# EAGLE design DHJSNoiseConsole (EAGLE 6.6.0)
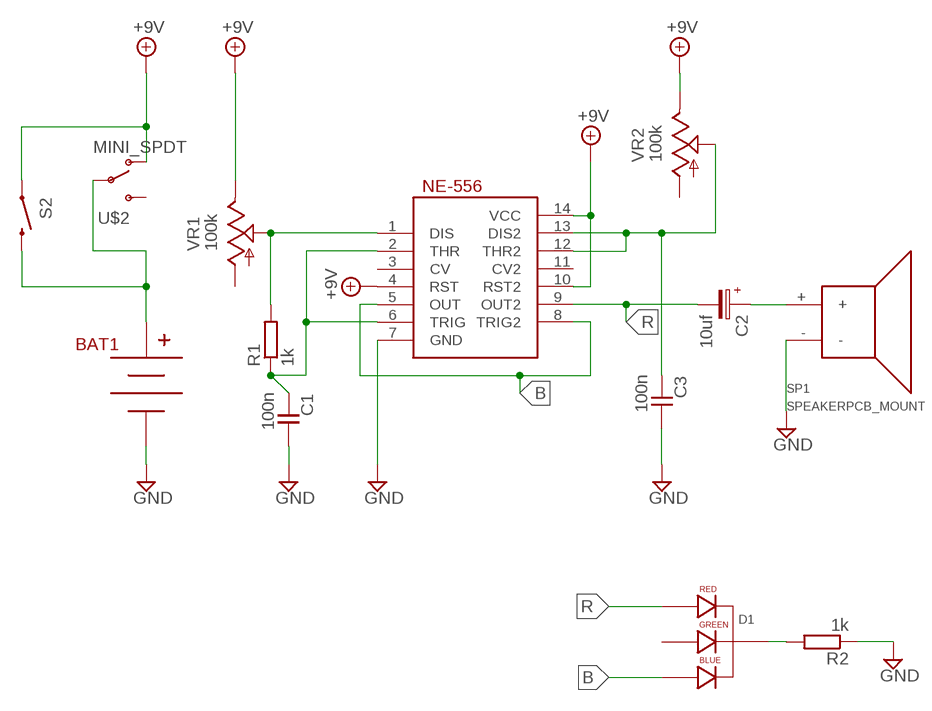
[diagram p0: schematic, sheet 1]

## Parts
BAT1  BC9VPC  [BC9VPC]
C1  100n  C-EU050-024X044  [C050-024X044]
C2  10uf  050-EU  [050_020]
C3  100n  C-EU050-024X044  [C050-024X044]
D1  LED-RGB-CC-THRUCLEAR  [LED-RGB-THRU]
NE-556  556  [DIL14]
R1  1k  RESISTOR10MM_RESISTOR  [10MM_RESISTOR]
R2  1k  RESISTOR10MM_RESISTOR  [10MM_RESISTOR]
S2  SWITCH-MOMENTARY-2SIDE_EZ  [TACTILE-PTH-SIDEEZ]
SP1  SPEAKERPCB_MOUNT  [PCB_MOUNT_SPEAKER]
U$2  MINI_SPDT  [MINI_SPDT_RIGHTANGLE]
VR1  100k  9MM_SNAP-IN_POT_  [9MM_SNAP-IN_POT]
VR2  100k  9MM_SNAP-IN_POT_  [9MM_SNAP-IN_POT]

## Nets
+9V: NE-556.4(RST) NE-556.10(RST2) NE-556.14(VCC) S2.1 U$2.UP(O) VR1.3(E) VR2.3(E)
B: D1.4(BLUE_CATHODE) NE-556.5(OUT) NE-556.8(TRIG2)
GND: BAT1.V- C1.1 C3.1 NE-556.7(GND) R2.1 SP1.-
N$1: NE-556.1(DIS) R1.2 VR1.2(S)
N$2: BAT1.V+ S2.2 U$2.COMMON
N$3: C3.2 NE-556.12(THR2) NE-556.13(DIS2) VR2.2(S)
N$4: D1.2(CATHODE) R2.2
N$6: C1.2 NE-556.2(THR) NE-556.6(TRIG) R1.1
N$7: C2.+ SP1.+
R: C2.- D1.1(RED_CATHODE) NE-556.9(OUT2)
Unconnected: D1.3(GREEN_CATHODE) NE-556.3(CV) NE-556.11(CV2) U$2.DOWN(S) VR1.1(A) VR2.1(A)

## Library data of the parts
BAT1 = SparkFun-Connectors:BC9VPC: 9V board-mount battery cradle; PROD_ID: BATT-10855
C1 C3 = TomW:C-EU: CAPACITOR, European symbol
C2 = gm-caps-electro-pol:050-EU
D1 = SparkFun-LED:LED-RGB-CC-THRU: RGB Through-hole common cathode LED SparkFun Storefront: COM-00105 (Clear) COM-09264 (Diffuse); PROD_ID: DIO-08418
NE-556 = SparkFun-AnalogIC:556: Dual timer circuit (2 555 timers in one package)
R1 R2 = MusicThingModular:RESISTOR: Standard resistor, various versions
S2 = SparkFun-Electromechanical:SWITCH-MOMENTARY-2: Various NO switches- pushbuttons, reed, etc
SP1 = SparkFun-Electromechanical:SPEAKER: General speakers.; MFG: SANCO; PROD_#: NA; SKU: COM-11089; SPARKLE_ID: 6504
U$2 = MusicThingModular:MINI_SPDT
VR1 VR2 = MusicThingModular:9MM_SNAP-IN_POT: 9mm vertical snap-in pot, Alpha / Panasonic style

## Net classes
0 default: width 0.61 mm

## Board
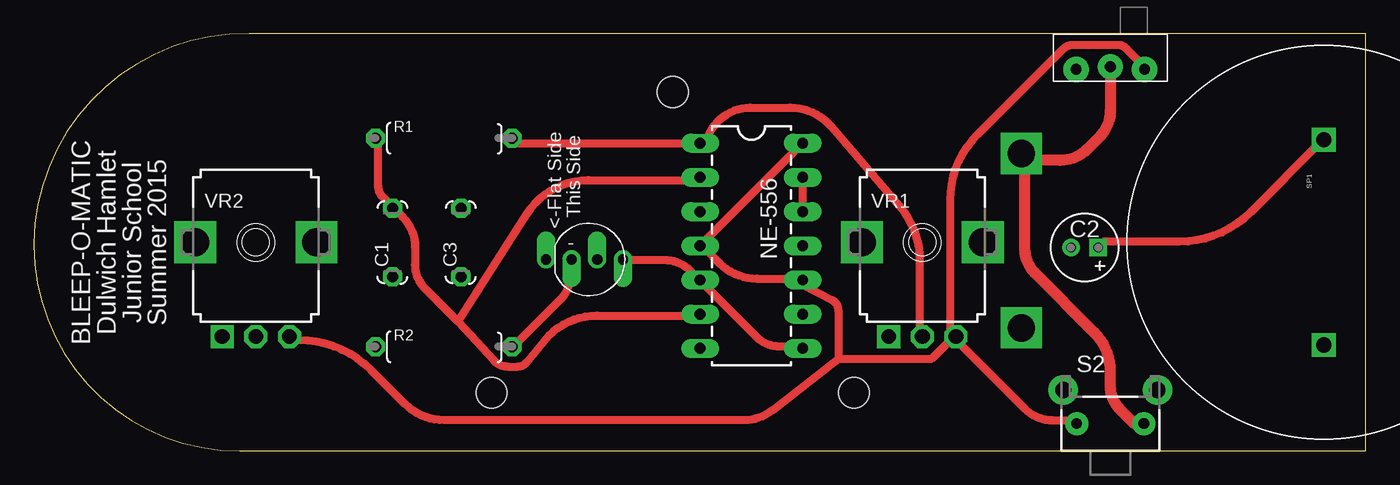
[diagram p1: board, top side]
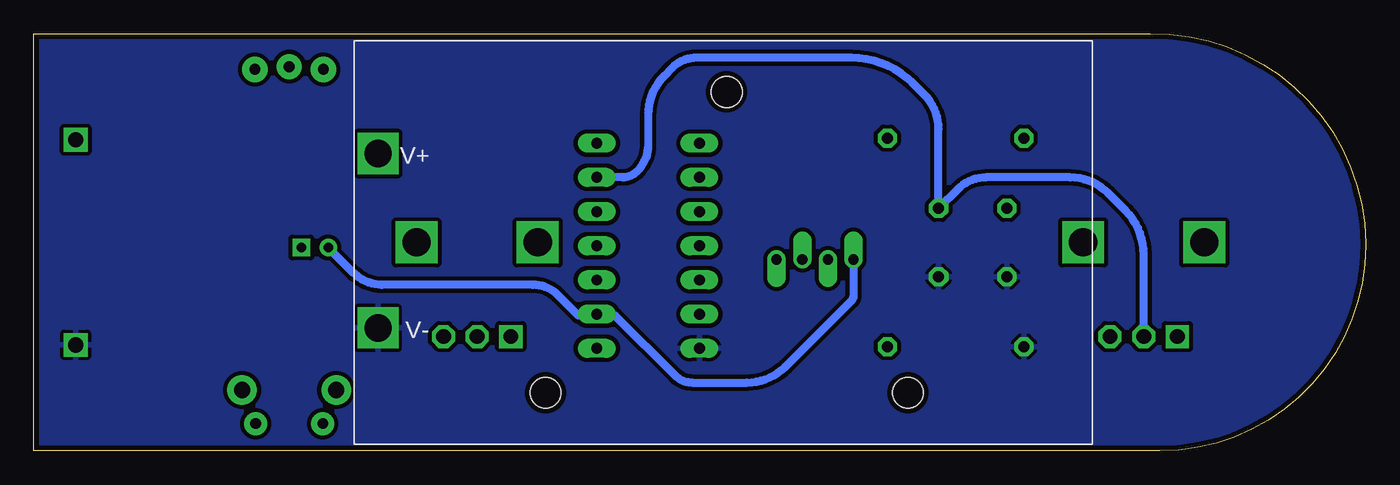
[diagram p2: board, bottom side, seen from below]

Size 99 x 31 mm. Coordinates in mm from the lower left corner, seen from the top.
Outline: 99,31 16.01,31 arc90 0,15.41 0,15.29 arc90 15.29,0 99,0 99,31
Copper layers (1*2*15*16): Top 0.035mm / dielectric 0.2mm / Route2 0.0175mm / dielectric 1.1mm / Route15 0.0175mm / dielectric 0.2mm / Bottom 0.035mm
Design rules "MT design rules rev2": minimum track width 6mil, minimum drill 12mil, track to track 12mil, track to pad 12mil, pad to pad 10mil, via to via 10mil, smd to smd 0mil, copper to edge 15mil, drill to drill 13mil, minimum pad ring 12mil, minimum via ring 6mil, stop-mask expansion 2mil, vias tented up to drill 25mil, thermal gap 10mil

### Footprints (pad centres in the part's own frame; a part is rotated, then mirrored left to right if it is on the bottom)
BC9VPC = drill 2.032 square: V+ 53.086,8.382; V- 53.086,21.336 | hole 2.286: 27.178,3.81; 13.716,26.162; 40.64,26.162
C050-024X044 = drill 0.813 octagon: 1 -2.54,0; 2 2.54,0
050_020 = drill 0.7 square: + -1,0 | drill 0.7: - 1,0
LED-RGB-THRU = drill 0.762 pad 0.889 offset: 1 3.175,0; 2 1.27,0; 3 -0.635,0; 4 -2.54,0
DIL14 = drill 0.813 long: 1 -8.89,-3.81; 2 -6.35,-3.81; 3 -3.81,-3.81; 4 -1.27,-3.81; 5 1.27,-3.81; 6 3.81,-3.81; 7 6.35,-3.81; 8 6.35,3.81; 9 3.81,3.81; 10 1.27,3.81; 11 -1.27,3.81; 12 -3.81,3.81; 13 -6.35,3.81; 14 -8.89,3.81
10MM_RESISTOR = drill 0.813 octagon: 1 -5.08,0; 2 5.08,0
TACTILE-PTH-SIDEEZ = drill 0.8 pad 1.7: 1 -2.5,0; 2 2.5,0 | drill 1.2 pad 2.2: ANCHOR1 -3.5,2.5; ANCHOR2 3.5,2.5
PCB_MOUNT_SPEAKER = drill 1.143 square: + -7.62,0; - 7.62,0
MINI_SPDT_RIGHTANGLE = drill 0.8 pad 1.88: COMMON -0.1,0; DOWN 0.1,-2.54; UP 0.1,2.54
9MM_SNAP-IN_POT = drill 1.1 pad 1.676 square: 1 -2.5,-7 | drill 1.1 pad 1.676 octagon: 2 0,-7; 3 2.5,-7 | drill 2.1 pad 2.8 square: M1 4.5,0; M2 -4.5,0

### Placement (x,y rotation side)
BAT1  20.32,30.48 180 bottom
C1  26.67,15.49 90 top
C2  78.11,15.11 180 top
C3  31.75,15.49 90 top
D1  41.25,14.23 180 top
NE-556  53.34,13.97 270 top
R1  30.48,23.24 0 top
R2  30.48,7.75 0 top
S2  80.01,2.03 0 top
SP1  95.88,15.5 270 top
U$1  [MTM_1CM_KEEPOUT]  92.71,19.05 0 bottom
U$2  80.01,28.45 270 top
VR1  66.04,15.5 0 top
VR2  16.51,15.5 0 top

### Tracks (layer width: path | path; a pad name or v marks a point on that pad's centre or on a via)
+9V
  Top 0.61: S2.1 77.27,2.29 75.69,2.29 arc-45 73.7,3.11 68.58,8.23 VR1.3 | U$2.UP 82.3,28.8 81.21,29.89 arc45 80.53,30.18 77.29,30.18 arc45 76.47,29.83 70.15,23.52 arc45 68.12,18.62 68.12,8.69 VR1.3 | NE-556.14 NE-556.4 49.84,15.09 50.98,13.95 arc45 53.74,12.8 57.15,12.8 NE-556.10 57.15,12.34 59.35,11.2 arc-63 59.79,10.47 59.79,6.86 | 59.79,6.86 54.86,3 arc-38 52.79,2.29 30.5,2.29 arc-45 27.61,3.48 25.09,6 arc45 19.7,8.23 19.2,8.23 VR2.3 | 59.79,6.86 66.75,6.86 68.12,8.23 VR1.3
B
  Top 0.61: D1.4 43.89,14.17 46.88,14.17 arc-45 48.8,13.38 49.38,12.8 NE-556.5 49.84,12.34 53.7,8.47 arc45 55.4,7.77 57.15,7.77 NE-556.8
GND
  pour Bottom: -1.27,34.29 100.33,35.56 100.33,-1.27 -1.27,-2.54
N$1
  Top 0.61: R1.2 35.66,22.86 NE-556.1 49.84,22.86 50.26,23.67 arc-63 53.27,25.5 56.22,25.5 arc-49 59.27,24.1 64.35,18.19 arc-41 65.84,14.18 65.84,8.69 VR1.2
N$2
  Top 0.813: S2.2 81.79,2.03 80.75,3.07 arc-45 80.01,4.86 80.01,5.96 arc45 78.83,8.8 74.4,13.23 arc-45 73.66,15.02 73.66,21.59 | 73.66,21.59 73.66,21.84 BAT1.V+ | U$2.COMMON 80.01,25.31 arc-45 79.18,23.3 78.3,22.42 arc-45 76.29,21.59 73.66,21.59
N$3
  Top 0.61: NE-556.13 NE-556.12
  Bottom 0.61: VR2.2 16.51,14.61 arc-45 17.85,17.85 19.14,19.14 arc-45 21.98,20.32 28.24,20.32 arc-45 30.33,19.45 C3.2 31.75,23.91 arc-45 32.8,26.45 33.66,27.31 arc-45 38.24,29.21 49.75,29.21 arc-45 51.54,28.47 52.16,27.85 arc-45 53.34,25.01 53.34,22.77 arc45 54.17,20.76 arc45 55.23,20.32 NE-556.13
N$4
  Top 0.61: D1.2 39.78,14.17 39.78,12.66 arc-45 39.23,11.34 35.66,7.77 R2.2
N$6
  Top 0.61: R1.1 25.6,22.86 25.6,19.65 arc45 25.92,18.89 26.52,18.29 C1.2 26.98,17.83 27.41,17.39 arc-45 28.35,15.14 28.35,13.81 arc45 29.06,12.09 31.55,9.6 | 31.55,9.6 34.21,6.72 arc47 35.23,6.27 35.99,6.27 arc50 36.62,6.57 38.3,8.58 arc-45 41.87,10.06 49.38,10.06 NE-556.6 | 31.55,9.6 36.65,17.61 arc-57 41.23,20.12 49.38,20.12 NE-556.2
N$7
  Top 0.61: C2.+ 79.55,15.54 85.14,15.54 arc45 90.43,17.74 95.56,22.86 SP1.+
R
  Bottom 0.61: C2.- 75.21,13.21 arc-45 73.11,12.34 61.89,12.34 arc45 60.04,11.58 58.52,10.06 57.15,10.06 | 57.15,10.06 55.78,10.06 51.33,5.61 arc-45 50.06,5.08 46,5.08 arc-45 43.13,6.27 38.19,11.21 arc-45 38.1,11.43 38.08,11.46 D1.1 | 57.15,10.06 NE-556.9

### Text on the board
tPlace: <-Flat Side / This Side | BLEEP-O-MATIC / Dulwich Hamlet / Junior School / Summer 2015 | -
bStop: + / DHJS | LONDON / 2015